# Altium schematic sheet InputAmplifier.SchDoc
size Tabloid; DocumentNumber: 11; SheetNumber: 11; SheetTotal: 11; SheetName: Audio input amplifier
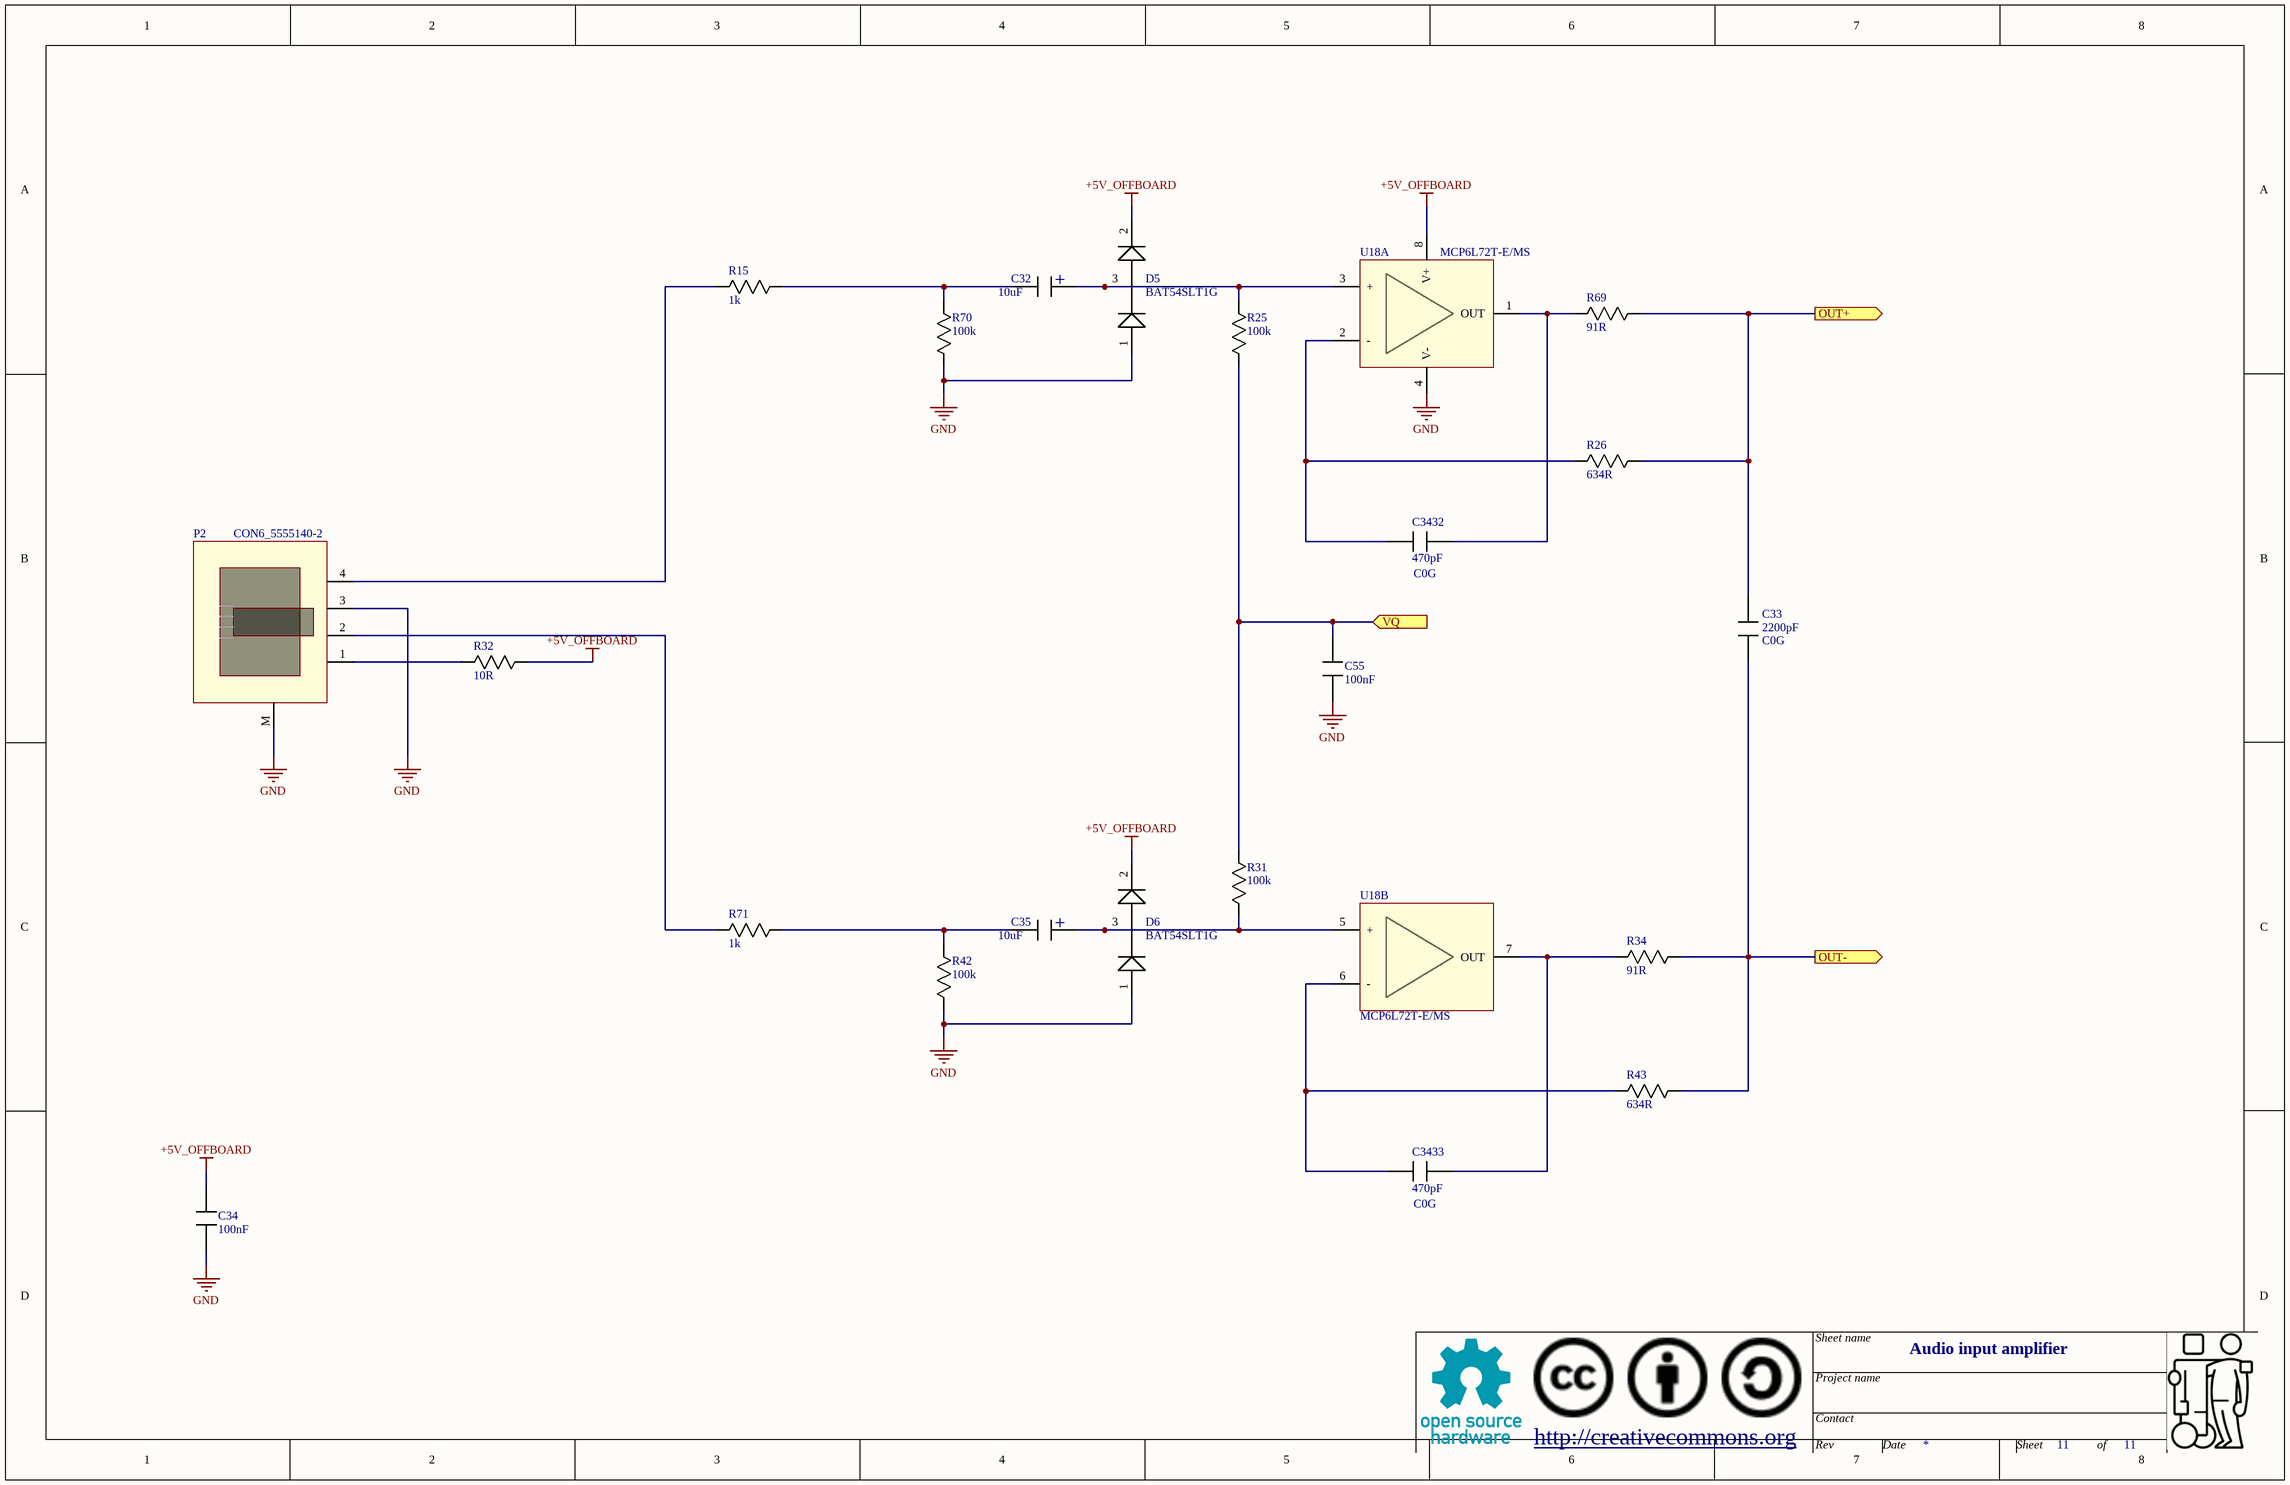
[diagram p0: InputAmplifier.SchDoc]

## Parts
C32  value 10uF  [CAP_RAD_SMD_DIA157]  (hidden comment: Capacitor_Polarized)
C33  value 2200pF  Type: C0G  [0603]  (hidden comment: Capacitor)
C34  value 100nF  [0603]  (hidden comment: Capacitor)
C35  value 10uF  [CAP_RAD_SMD_DIA157]  (hidden comment: Capacitor_Polarized)
C55  value 100nF  [0603]  (hidden comment: Capacitor)
C3432  value 470pF  Type: C0G  [0603]  (hidden comment: Capacitor)
C3433  value 470pF  Type: C0G  [0603]  (hidden comment: Capacitor)
D5  Mfg_PN: BAT54SLT1G  [SOT23_132]  (hidden comment: Diode_dual)
D6  Mfg_PN: BAT54SLT1G  [SOT23_132]  (hidden comment: Diode_dual)
P2  CON6_5555140-2  [CONN4_5555140-2]
R15  value 1k  [0603]  (hidden comment: Resistor)
R25  value 100k  [0603]  (hidden comment: Resistor)
R26  value 634R  [0603]  (hidden comment: Resistor)
R31  value 100k  [0603]  (hidden comment: Resistor)
R32  value 10R  [0603]  (hidden comment: Resistor)
R34  value 91R  [0603]  (hidden comment: Resistor)
R42  value 100k  [0603]  (hidden comment: Resistor)
R43  value 634R  [0603]  (hidden comment: Resistor)
R69  value 91R  [0603]  (hidden comment: Resistor)
R70  value 100k  [0603]  (hidden comment: Resistor)
R71  value 1k  [0603]  (hidden comment: Resistor)
U18  Mfg_PN: MCP6L72T-E/MS  [SOP127P600-8N]  (hidden comment: OPA_DUAL)  (parts A,B of 2)

## Ports
OUT+ (out), OUT- (out), VQ (in)

## Nets
+5V_OFFBOARD: C34.1 D5.2(K) D6.2(K) R32.2 U18.8(V+)
GND: C34.2 C55.2 D5.1(K) D6.1(K) P2.3 P2.M R42.1 R70.1 U18.4(V-)
OUT+: C33.1 R26.2 R69.2 ; port OUT+
OUT-: C33.2 R34.2 R43.2 ; port OUT-
VQ: C55.1 R25.1 R31.2 ; port VQ
NetC32_+: C32.+ D5.3(AK) R25.2 U18.3(+)
NetC32_-: C32.- R15.2 R70.2
NetC35_+: C35.+ D6.3(AK) R31.1 U18.5(+)
NetC35_-: C35.- R42.2 R71.2
NetC3432_1: C3432.1 R26.1 U18.2(-)
NetC3432_2: C3432.2 R69.1 U18.1(OUT)
NetC3433_1: C3433.1 R43.1 U18.6(-)
NetC3433_2: C3433.2 R34.1 U18.7(OUT)
NetP2_1: P2.1 R32.1
NetP2_2: P2.2 R71.1
NetP2_4: P2.4 R15.1

## Notes on the sheet
- Sheet name
- http://creativecommons.org
- Project name
- Contact
- Rev
- Date
- Sheet
- of

## Library data of the parts
C32 C35 = Capacitor_Polarized: Capacitor; Mfg: Nichicon; Mfg_PN: UWX1C100MCL1GB; HelpURL: *; NI: *; Supplier1: Digikey; Supplier1_PN: 493-2100-1-ND; Tolerance: *; Type: *; Rating: *
C33 = Capacitor: Mfg: Murata; Mfg_PN: GRM1885C1H222JA01D; HelpURL: *; NI: *; Supplier1: Digikey; Supplier1_PN: 490-1459-1-ND; Tolerance: *; Rating: *
C34 C55 = Capacitor: Mfg: Samsung; Mfg_PN: CL10F104ZO8NNNC; HelpURL: *; NI: *; Supplier1: Digikey; Supplier1_PN: 1276-1258-1-ND; Tolerance: *; Type: *; Rating: *
C3432 C3433 = Capacitor: Mfg: Samsung; Mfg_PN: CL10C471JB8NCNC; HelpURL: *; NI: *; Supplier1: Digikey; Supplier1_PN: 1276-2302-1-ND; Tolerance: *; Rating: *
D5 D6 = Diode_dual: Diode; Mfg: Onsemi; HelpURL: *; NI: *; Supplier1: Digikey; Supplier1_PN: BAT54SLT1GOSCT-ND; Tolerance: *; Type: *; Rating: *; Value: *
P2 = CON6_5555140-2: 6p4c RJ11/RJ14, shielded (5555165-2 unshielded); Mfg: TE; HelpURL: *; Mfg_PN: 5555140-2; NI: *; Rating: *; Supplier1: Digikey; Supplier1_PN: A31436-ND; Tolerance: *; Type: *; Value: *
R15 R71 = Resistor: Mfg: Yageo; Mfg_PN: RC0603JR-071KL; HelpURL: *; NI: *; Supplier1: Digikey; Supplier1_PN: 311-1.0KGRCT-ND; Type: *; Rating: *; Tolerance: *
R25 R31 R42 R70 = Resistor: Mfg: Yageo; Mfg_PN: 311-10GRCT-ND; HelpURL: *; NI: *; Supplier1: Digikey; Supplier1_PN: 311-100KGRCT-ND; Type: *; Rating: *; Tolerance: *
R26 R43 = Resistor: Mfg: Yageo; Mfg_PN: RC0603FR-07634RL; HelpURL: *; NI: *; Supplier1: Digikey; Supplier1_PN: 311-634HRCT-ND; Type: *; Rating: *; Tolerance: *
R32 = Resistor: Mfg: Yageo; Mfg_PN: RC0603JR-0710RL; HelpURL: *; NI: *; Supplier1: Digikey; Supplier1_PN: 311-10GRCT-ND; Type: *; Rating: *; Tolerance: *
R34 R69 = Resistor: Mfg: Yageo; Mfg_PN: RC0603JR-0791RL; HelpURL: *; NI: *; Supplier1: Digikey; Supplier1_PN: 311-91GRCT-ND; Type: *; Rating: *; Tolerance: *
U18 = OPA_DUAL: Dual amplifier (standard); Mfg: Microchip; HelpURL: *; NI: *; Rating: *; Supplier1: Digikey; Supplier1_PN: MCP6L72T-E/MSCT-ND; Tolerance: *; Value: *